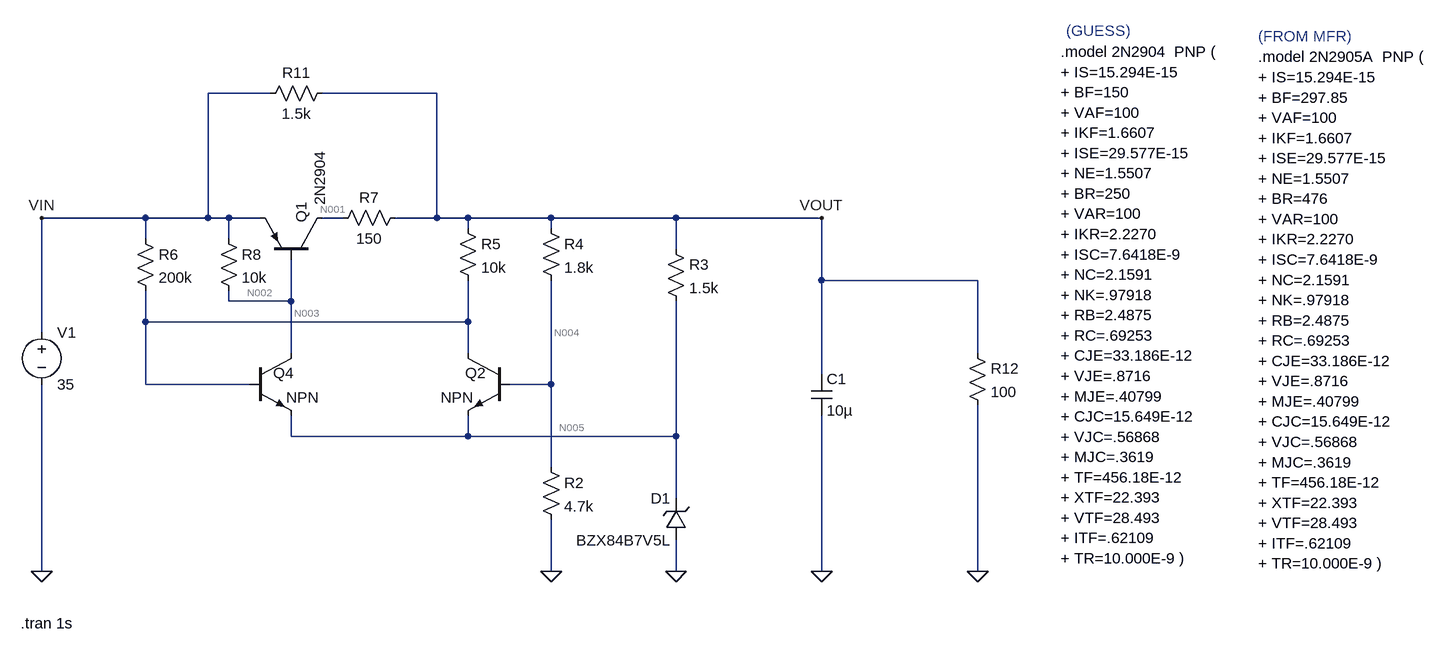
[diagram p0: schematic Balantron power.asc]
Balantron power.asc, the LTspice schematic file:
Version 4
SHEET 1 1828 752
WIRE 32 -80 -64 -80
WIRE 288 -80 112 -80
WIRE -160 112 -320 112
WIRE -64 112 -64 -80
WIRE -64 112 -160 112
WIRE -32 112 -64 112
WIRE 16 112 -32 112
WIRE 144 112 112 112
WIRE 288 112 288 -80
WIRE 288 112 224 112
WIRE 336 112 288 112
WIRE 464 112 336 112
WIRE 656 112 464 112
WIRE 880 112 656 112
WIRE 336 128 336 112
WIRE 464 128 464 112
WIRE -160 144 -160 112
WIRE -32 144 -32 112
WIRE 656 160 656 112
WIRE 880 208 880 112
WIRE 1120 208 880 208
WIRE -32 240 -32 224
WIRE 64 240 64 176
WIRE 64 240 -32 240
WIRE -160 272 -160 224
WIRE 336 272 336 208
WIRE 336 272 -160 272
WIRE -320 288 -320 112
WIRE 64 320 64 240
WIRE 336 320 336 272
WIRE 1120 320 1120 208
WIRE 880 352 880 208
WIRE -160 368 -160 272
WIRE 0 368 -160 368
WIRE 464 368 464 208
WIRE 464 368 400 368
WIRE 64 448 64 416
WIRE 336 448 336 416
WIRE 336 448 64 448
WIRE 656 448 656 240
WIRE 656 448 336 448
WIRE 464 496 464 368
WIRE 656 544 656 448
WIRE -320 656 -320 368
WIRE 464 656 464 576
WIRE 656 656 656 608
WIRE 880 656 880 416
WIRE 1120 656 1120 400
FLAG -320 656 0
FLAG 880 656 0
FLAG 880 112 VOUT
FLAG -320 112 VIN
FLAG 464 656 0
FLAG 656 656 0
FLAG 1120 656 0
SYMBOL pnp 112 176 M270
WINDOW 3 84 4 Left 2
SYMATTR InstName Q1
SYMATTR Value 2N2904
SYMBOL voltage -320 272 R0
WINDOW 123 0 0 Left 2
WINDOW 39 0 0 Left 2
SYMATTR InstName V1
SYMATTR Value 35
SYMBOL res 128 -96 R90
WINDOW 0 0 56 VBottom 2
WINDOW 3 32 56 VTop 2
SYMATTR InstName R11
SYMATTR Value 1.5k
SYMBOL res 240 96 R90
WINDOW 0 0 56 VBottom 2
WINDOW 3 32 56 VTop 2
SYMATTR InstName R7
SYMATTR Value 150
SYMBOL cap 864 352 R0
SYMATTR InstName C1
SYMATTR Value 10µ
SYMBOL res -48 128 R0
SYMATTR InstName R8
SYMATTR Value 10k
SYMBOL res -176 128 R0
SYMATTR InstName R6
SYMATTR Value 200k
SYMBOL res 448 112 R0
SYMATTR InstName R4
SYMATTR Value 1.8k
SYMBOL res 640 144 R0
SYMATTR InstName R3
SYMATTR Value 1.5k
SYMBOL res 448 480 R0
SYMATTR InstName R2
SYMATTR Value 4.7k
SYMBOL res 1104 304 R0
SYMATTR InstName R12
SYMATTR Value 100
SYMBOL npn 0 320 R0
WINDOW 0 36 31 Left 2
SYMATTR InstName Q4
SYMBOL npn 400 320 M0
WINDOW 0 36 31 Left 2
SYMATTR InstName Q2
SYMBOL zener 672 608 R180
WINDOW 0 24 64 Left 2
WINDOW 3 24 0 Left 2
SYMATTR InstName D1
SYMATTR Value BZX84B7V5L
SYMATTR Description Diode
SYMATTR Type diode
SYMBOL res 320 112 R0
SYMATTR InstName R5
SYMATTR Value 10k
TEXT -352 736 Left 2 !.tran 1s
TEXT 1248 -144 Left 2 !.model 2N2904  PNP (\n+ IS=15.294E-15\n+ BF=150\n+ VAF=100\n+ IKF=1.6607\n+ ISE=29.577E-15\n+ NE=1.5507\n+ BR=250\n+ VAR=100\n+ IKR=2.2270\n+ ISC=7.6418E-9\n+ NC=2.1591\n+ NK=.97918\n+ RB=2.4875\n+ RC=.69253\n+ CJE=33.186E-12\n+ VJE=.8716\n+ MJE=.40799\n+ CJC=15.649E-12\n+ VJC=.56868\n+ MJC=.3619\n+ TF=456.18E-12\n+ XTF=22.393\n+ VTF=28.493\n+ ITF=.62109\n+ TR=10.000E-9 )
TEXT 1552 -136 Left 2 !.model 2N2905A  PNP (\n+ IS=15.294E-15\n+ BF=297.85\n+ VAF=100\n+ IKF=1.6607\n+ ISE=29.577E-15\n+ NE=1.5507\n+ BR=476\n+ VAR=100\n+ IKR=2.2270\n+ ISC=7.6418E-9\n+ NC=2.1591\n+ NK=.97918\n+ RB=2.4875\n+ RC=.69253\n+ CJE=33.186E-12\n+ VJE=.8716\n+ MJE=.40799\n+ CJC=15.649E-12\n+ VJC=.56868\n+ MJC=.3619\n+ TF=456.18E-12\n+ XTF=22.393\n+ VTF=28.493\n+ ITF=.62109\n+ TR=10.000E-9 )
TEXT 1256 -176 Left 2 ;(GUESS)
TEXT 1552 -168 Left 2 ;(FROM MFR)

The netlist it stands for:
* Balantron power.asc
Q1 N001 N002 VIN 0 2N2904
V1 VIN 0 35
R11 VOUT VIN 1.5k
R7 VOUT N001 150
C1 VOUT 0 10µ
R8 VIN N002 10k
R6 VIN N003 200k
R4 VOUT N004 1.8k
R3 VOUT N005 1.5k
R2 N004 0 4.7k
R12 VOUT 0 100
Q4 N002 N003 N005 0 NPN
Q2 N003 N004 N005 0 NPN
D1 0 N005 BZX84B7V5L
R5 VOUT N003 10k
.model D D
.lib standard.dio
.model NPN NPN
.model PNP PNP
.lib standard.bjt
.tran 1s
.model 2N2904  PNP (
+ IS=15.294E-15
+ BF=150
+ VAF=100
+ IKF=1.6607
+ ISE=29.577E-15
+ NE=1.5507
+ BR=250
+ VAR=100
+ IKR=2.2270
+ ISC=7.6418E-9
+ NC=2.1591
+ NK=.97918
+ RB=2.4875
+ RC=.69253
+ CJE=33.186E-12
+ VJE=.8716
+ MJE=.40799
+ CJC=15.649E-12
+ VJC=.56868
+ MJC=.3619
+ TF=456.18E-12
+ XTF=22.393
+ VTF=28.493
+ ITF=.62109
+ TR=10.000E-9 )
.model 2N2905A  PNP (
+ IS=15.294E-15
+ BF=297.85
+ VAF=100
+ IKF=1.6607
+ ISE=29.577E-15
+ NE=1.5507
+ BR=476
+ VAR=100
+ IKR=2.2270
+ ISC=7.6418E-9
+ NC=2.1591
+ NK=.97918
+ RB=2.4875
+ RC=.69253
+ CJE=33.186E-12
+ VJE=.8716
+ MJE=.40799
+ CJC=15.649E-12
+ VJC=.56868
+ MJC=.3619
+ TF=456.18E-12
+ XTF=22.393
+ VTF=28.493
+ ITF=.62109
+ TR=10.000E-9 )
* (GUESS)
* (FROM MFR)
.backanno
.end

* Results of the author's LTspice run, read from the files saved beside the schematic
* Operating Point, zero values left out:
*   V(n001) = 26.9 V
*   V(n002) = 34.23 V
*   V(vin) = 35 V
*   V(vout) = 11.42 V
*   V(n003) = 8.268 V
*   V(n004) = 8.252 V
*   V(n005) = 7.499 V
*   Ic(Q2) = 440.8 µA
*   Ib(Q2) = 4.408 µA
*   Ie(Q2) = -445.2 µA
*   Ic(Q4) = 811.3 µA
*   Ib(Q4) = 8.113 µA
*   Ie(Q4) = -819.5 µA
*   Ic(Q1) = -103.2 mA
*   Ib(Q1) = -734.6 µA
*   Ie(Q1) = 103.9 mA
*   I(D1) = -3.879 mA
*   I(R5) = 315.2 µA
*   I(R12) = 114.2 mA
*   I(R2) = 1.756 mA
*   I(R3) = 2.614 mA
*   I(R4) = 1.76 mA
*   I(R6) = 133.7 µA
*   I(R8) = 76.74 µA
*   I(R7) = -103.2 mA
*   I(R11) = -15.72 mA
*   I(V1) = -119.8 mA